# EAGLE design doorbellboard (EAGLE 7.5.0)
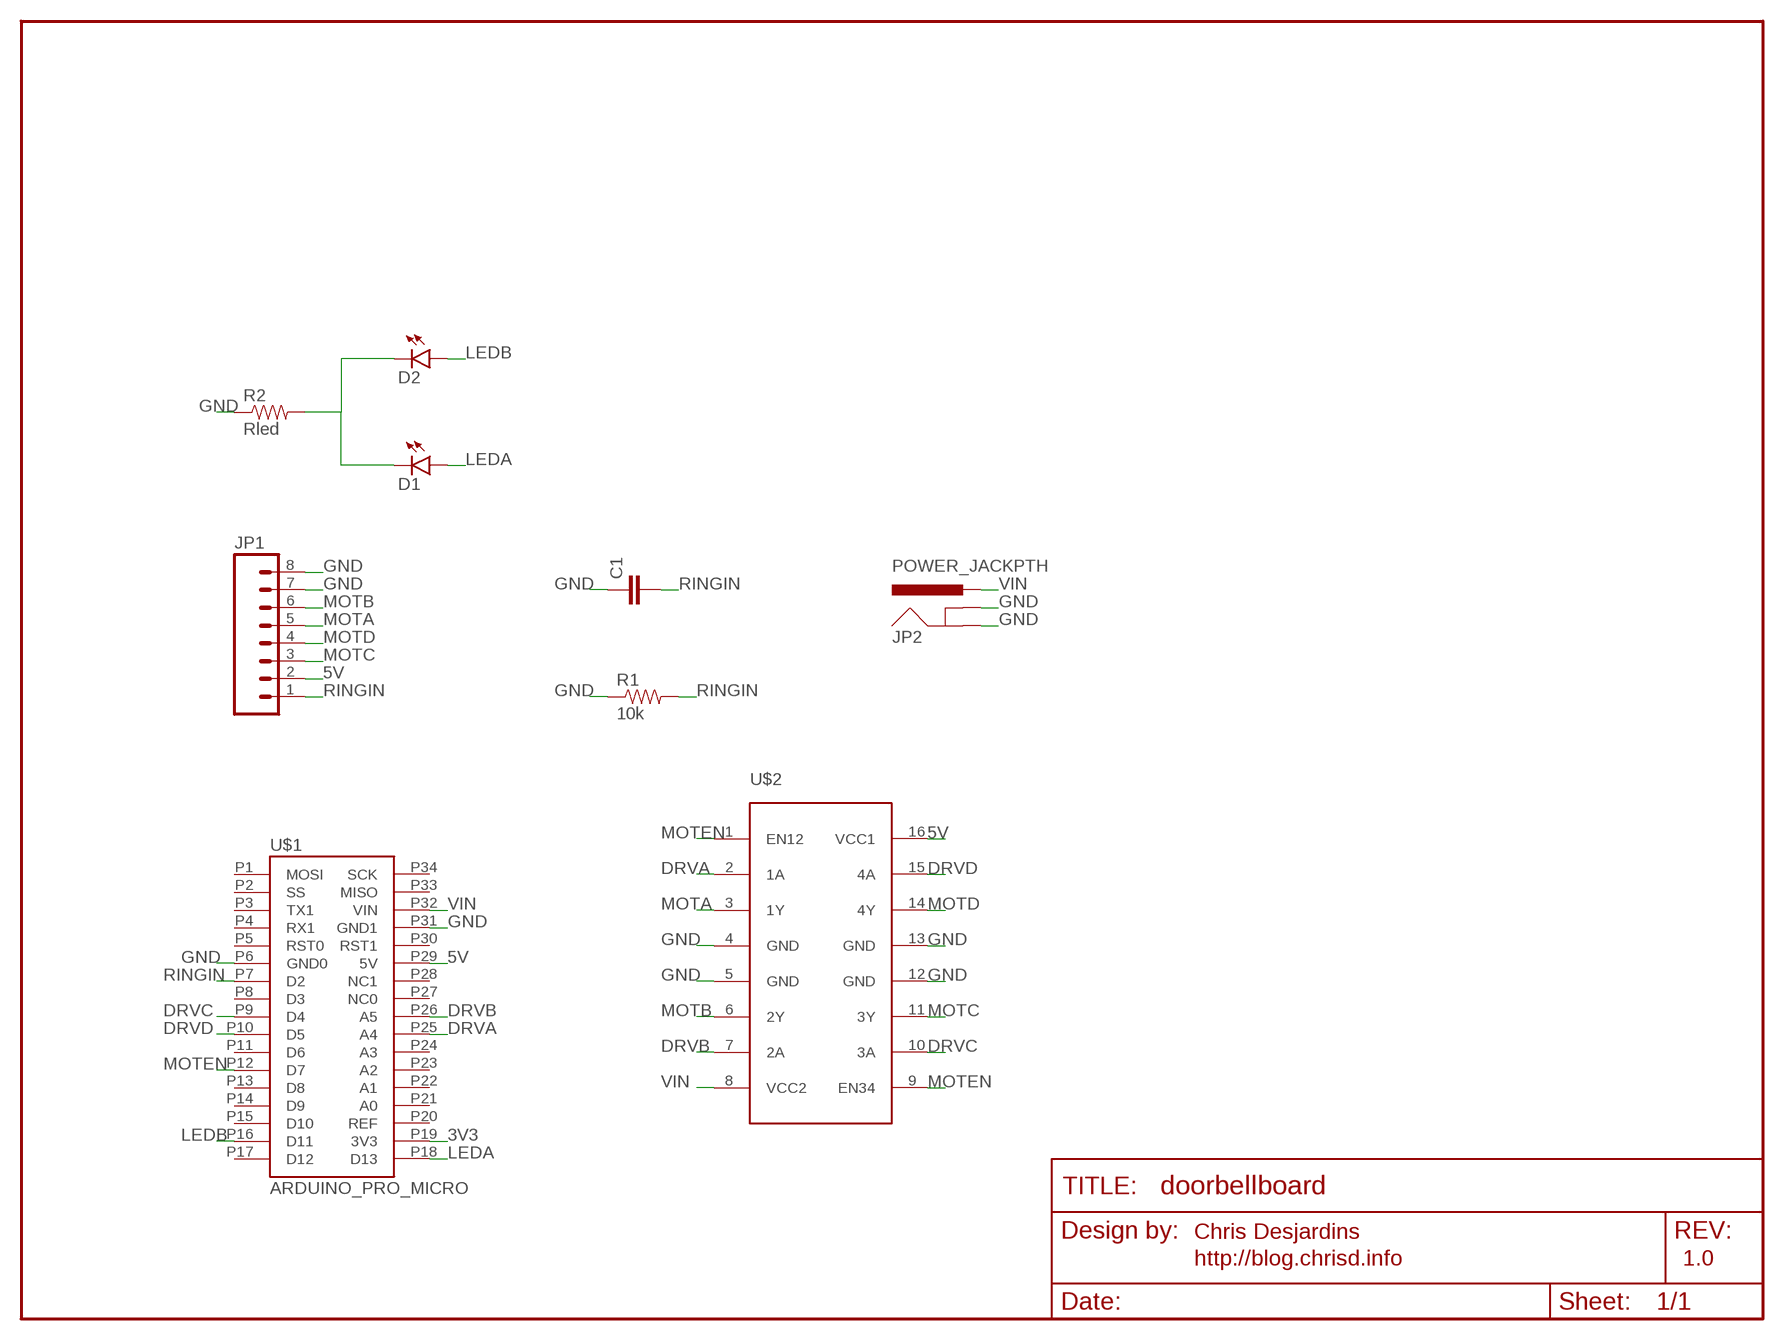
[diagram p0: schematic, sheet 1]

## Parts
C1  0.1UF-50V-20%(PTH)KIT-EZ  [CAP-PTH-SMALL-KIT]
D1  LED-3MM-NO_SILK  [LED3MM-NS]
D2  LED-3MM-NO_SILK  [LED3MM-NS]
JP1  M08  [1X08_ROUND]
JP2  POWER_JACKPTH  [POWER_JACK_PTH]
R1  10k  10KOHM-1/4W-1%(PTH)HORIZ  [AXIAL-0.3]
R2  Rled  10KOHM-1/4W-1%(PTH)HORIZ  [AXIAL-0.3]
U$1  ARDUINO_PRO_MICRO  [ARDUINO_PRO_MICRO]
U$2  SN754410  [DIL16-KIT]

## Nets
3V3: U$1.P19(3V3)
5V: JP1.2 U$1.P29(5V) U$2.16(VCC1)
DRVA: U$1.P25(A4) U$2.2(1A)
DRVB: U$1.P26(A5) U$2.7(2A)
DRVC: U$1.P9(D4) U$2.10(3A)
DRVD: U$1.P10(D5) U$2.15(4A)
GND: C1.1 JP1.7 JP1.8 JP2.GND JP2.GNDBREAK R1.P$1 R2.P$1 U$1.P6(GND0) U$1.P31(GND1) U$2.4(GND) U$2.5(GND) U$2.12(GND) U$2.13(GND)
LEDA: D1.A U$1.P18(D13)
LEDB: D2.A U$1.P16(D11)
LEDOUT: D1.K(C) D2.K(C) R2.P$2
MOTA: JP1.5 U$2.3(1Y)
MOTB: JP1.6 U$2.6(2Y)
MOTC: JP1.3 U$2.11(3Y)
MOTD: JP1.4 U$2.14(4Y)
MOTEN: U$1.P12(D7) U$2.1(EN12) U$2.9(EN34)
RINGIN: C1.2 JP1.1 R1.P$2 U$1.P7(D2)
VIN: JP2.PWR U$1.P32(VIN) U$2.8(VCC2)
Unconnected: U$1.P1(MOSI) U$1.P2(SS) U$1.P3(TX1) U$1.P4(RX1) U$1.P5(RST0) U$1.P8(D3) U$1.P11(D6) U$1.P13(D8) U$1.P14(D9) U$1.P15(D10) U$1.P17(D12) U$1.P21(A0) U$1.P22(A1) U$1.P23(A2) U$1.P24(A3) U$1.P27(NC0) U$1.P28(NC1) U$1.P30(RST1) U$1.P33(MISO) U$1.P34(SCK)

## Notes on the sheet
- Chris Desjardins
- http://blog.chrisd.info | 1.0

## Power pins joined to a net without a drawn wire
REF: U$1.P20(REF)

## Library data of the parts
C1 = SparkFun-Capacitors:0.1UF-50V-20%(PTH): CAP-08370; PROD_ID: CAP-08370
D1 D2 = SparkFun-LED:LED: LEDs Standard schematic elements and footprints for 5mm, 3mm, 1206, and 0603 sized LEDs. 5mm - Spark Fun Electronics SKU : COM-00529 (and others)
JP1 = SparkFun-Connectors:M08: Header 8 Standard 8-pin 0.1" header. Use with straight break away headers (SKU : PRT-00116), right angle break away headers (PRT-00553), swiss pins (PRT-00743), machine pins (PRT-00117), and female headers (PRT-00115).
JP2 = SparkFun-Connectors:POWER_JACK: Power Jack This is the standard 5.5mm barrel jack for power. The PTH is the most common, proven, reliable, footprint. The Slot footprint only works if the mill layer is transmitted to the PCB fab house so be warned. Mating wall wart : TOL-00298 (and others); PROD_ID: CONN-08197
R1 = SparkFun-Resistors:10KOHM-1/4W-1%(PTH): RES-12183; PROD_ID: RES-12183
R2 = SparkFun-Resistors:10KOHM-1/4W-1%(PTH): RES-12183; PROD_ID: RES-12183; VALUE: 10k
U$1 = ChrisD:ARDUINO_PRO_MICRO
U$2 = desjardins:SN754410

## Board
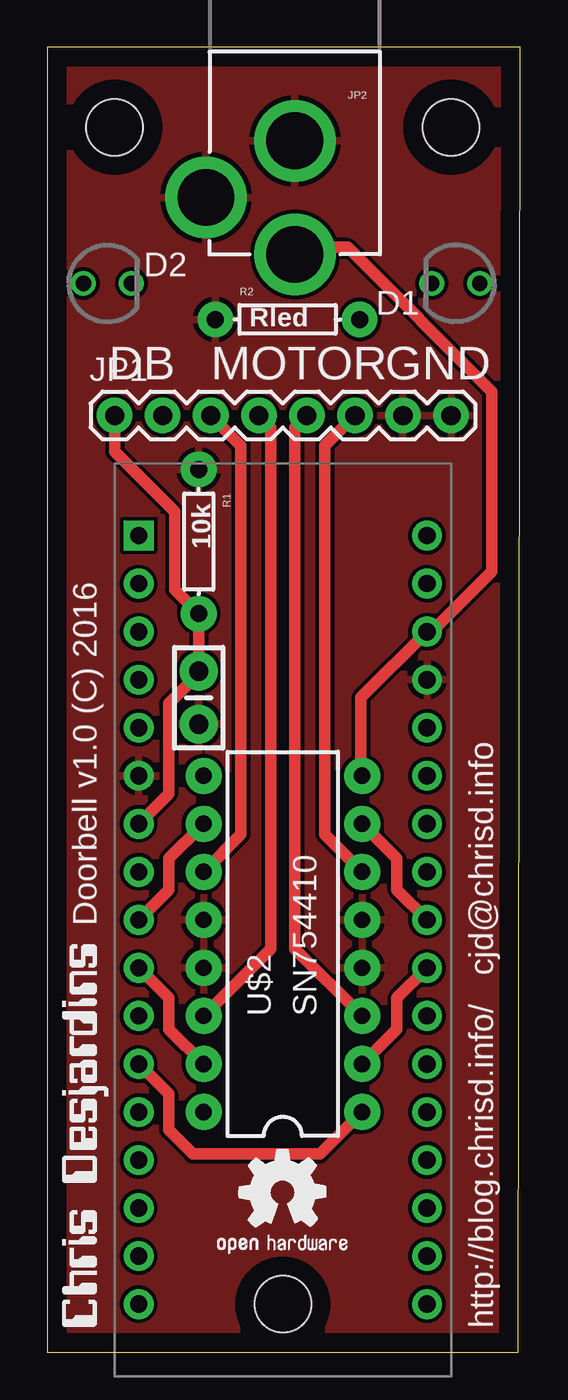
[diagram p1: board, top side]
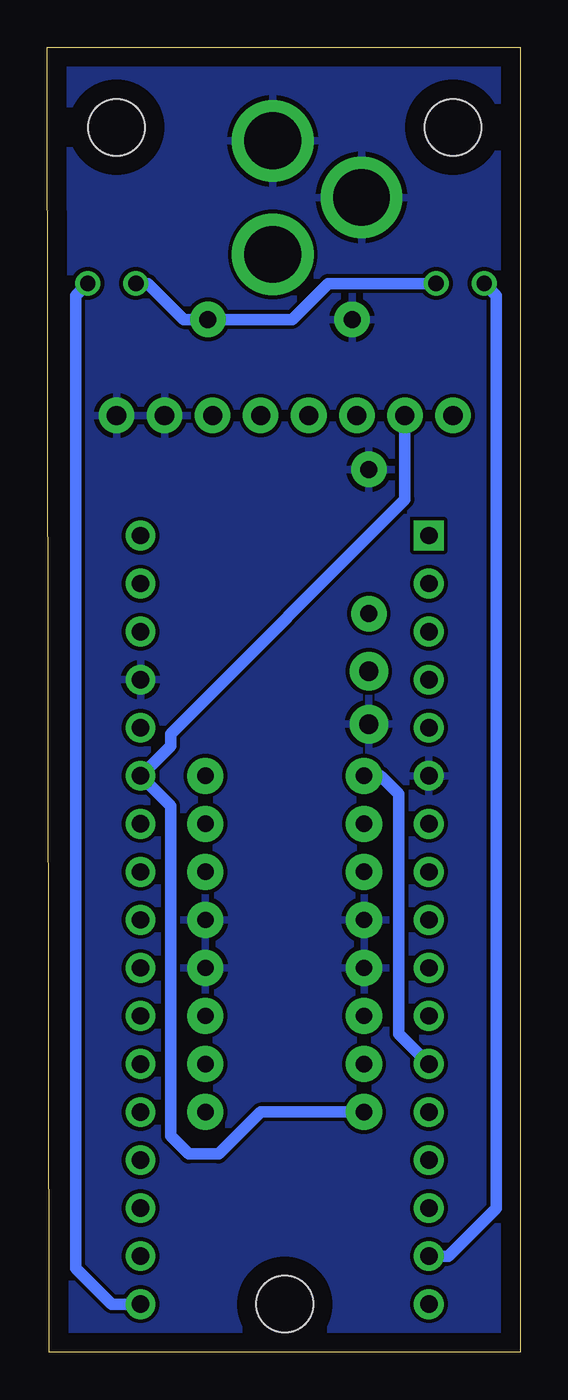
[diagram p2: board, bottom side, seen from below]

Size 25 x 69 mm. Coordinates in mm from the lower left corner, seen from the top.
Outline: 0,0 24.9,0 25,69 0,69 0,0
Copper layers (1*16): Top 0.035mm / dielectric 1.5mm / Bottom 0.035mm
Design rules "default": minimum track width 10mil, minimum drill 24mil, track to track 8mil, track to pad 8mil, pad to pad 8mil, via to via 8mil, smd to smd 8mil, copper to edge 40mil, drill to drill 8mil, minimum pad ring 10mil, minimum via ring 8mil, stop-mask expansion 4mil, vias tented up to drill 0mil, thermal gap 10mil
Holes 3 mm at 21.34,64.77 3.56,64.77 12.45,2.54

### Footprints (pad centres in the part's own frame; a part is rotated, then mirrored left to right if it is on the bottom)
CAP-PTH-SMALL-KIT = drill 1.016 pad 2.032: 1 -1.397,0; 2 1.397,0
LED3MM-NS = drill 0.813: A -1.27,0; K 1.27,0
1X08_ROUND = drill 1.016 pad 1.88: 1 0,0; 2 2.54,0; 3 5.08,0; 4 7.62,0; 5 10.16,0; 6 12.7,0; 7 15.24,0; 8 17.78,0
POWER_JACK_PTH = drill 2.997 pad 4.318: GND 0,7.7; GNDBREAK 4.7,10.7; PWR 0,13.7
AXIAL-0.3 = drill 0.9 pad 1.88: P$1 -3.81,0; P$2 3.81,0
ARDUINO_PRO_MICRO = drill 0.914 pad 1.575 square: P1 1.27,44.45 | drill 0.914 pad 1.575: P2 1.27,41.91; P3 1.27,39.37; P4 1.27,36.83; P5 1.27,34.29; P6 1.27,31.75; P7 1.27,29.21; P8 1.27,26.67; P9 1.27,24.13; P10 1.27,21.59; P11 1.27,19.05; P12 1.27,16.51; P13 1.27,13.97; P14 1.27,11.43; P15 1.27,8.89; P16 1.27,6.35; P17 1.27,3.81; P18 16.51,3.81; P19 16.51,6.35; P20 16.51,8.89; P21 16.51,11.43; P22 16.51,13.97; P23 16.51,16.51; P24 16.51,19.05; P25 16.51,21.59; P26 16.51,24.13; P27 16.51,26.67; P28 16.51,29.21; P29 16.51,31.75; P30 16.51,34.29; P31 16.51,36.83; P32 16.51,39.37; P33 16.51,41.91; P34 16.51,44.45
DIL16-KIT = drill 0.864 pad 1.905: 1 -8.89,-4.191; 2 -6.35,-4.191; 3 -3.81,-4.191; 4 -1.27,-4.191; 5 1.27,-4.191; 6 3.81,-4.191; 7 6.35,-4.191; 8 8.89,-4.191; 9 8.89,4.191; 10 6.35,4.191; 11 3.81,4.191; 12 1.27,4.191; 13 -1.27,4.191; 14 -3.81,4.191; 15 -6.35,4.191; 16 -8.89,4.191

### Placement (x,y rotation side)
C1  8.01,34.61 90 top
D1  21.59,56.52 180 top
D2  3.17,56.52 0 top
JP1  3.56,49.53 0 top
JP2  13.09,71.75 180 top
R1  8.01,42.86 270 top
R2  12.7,54.61 0 top
U$1  3.56,-1.27 0 top
U$2  12.45,21.59 90 top
U$3  [LOGO]  2.61,1.27 90 top
U$4  [OSHW2]  8.61,4.17 0 top

### Tracks (layer width: path | path; a pad name or v marks a point on that pad's centre or on a via)
5V
  Bottom 0.61: U$2.16 13.72,12.7 15.94,10.48 17.53,10.48 18.48,11.43 18.48,28.89 U$1.P29 18.48,32.07 18.48,32.7 6.1,45.09 JP1.2
DRVA
  Top 0.61: U$1.P25 18.48,18.73 18.48,17.08 U$2.2
DRVB
  Top 0.61: U$1.P26 18.48,24.45 18.48,26.1 U$2.7
DRVC
  Top 0.61: U$1.P9 6.42,24.45 6.42,26.1 U$2.10
DRVD
  Top 0.61: U$1.P10 6.42,18.73 6.42,17.08 U$2.15
GND
  pour Bottom: 0,0 0,69 25,69 24.9,0
  pour Top: 0,0 0,69 25,69 25,0
LEDA
  Bottom 0.61: U$1.P18 21.59,2.54 23.5,4.45 23.5,55.88 D1.A
LEDB
  Bottom 0.61: U$1.P16 3.81,5.08 1.27,7.62 1.27,55.88 D2.A
LEDOUT
  Bottom 0.61: D2.K 10.16,56.52 12.06,54.61 R2.P$2 17.78,54.61 19.68,56.52 D1.K
MOTA
  Top 0.61: JP1.5 13.09,48.9 13.09,21.34 U$2.3
MOTB
  Top 0.61: JP1.6 14.67,47.94 14.67,27.37 U$2.6
MOTC
  Top 0.61: JP1.3 10.23,47.94 10.23,27.37 U$2.11
MOTD
  Top 0.61: JP1.4 11.81,48.9 11.81,21.34 U$2.14
MOTEN
  Top 0.61: U$1.P12 6.42,13.65 6.42,11.75 7.69,10.48 14.42,10.48 U$2.1
  Bottom 0.61: U$2.9 7.37,30.48 6.42,29.53 6.42,16.83 U$1.P12
RINGIN
  Top 0.61: JP1.1 3.56,47.62 6.74,44.45 6.74,40.32 R1.P$2 C1.2 8.01,35.88 6.42,34.29 6.42,29.53 U$1.P7
VIN
  Top 0.61: U$2.8 16.58,30.54 16.58,34.61 U$1.P32 20.32,38.1 23.5,41.27 23.5,50.8 15.88,58.42 13.45,58.42 JP2.PWR

### Text on the board
tPlace: DB | MOTOR | GND | Doorbell v1.0 (C) 2016 | http://blog.chrisd.info/ cjd@chrisd.info